# EAGLE design pipower-screw-gndplane (EAGLE 6.3)
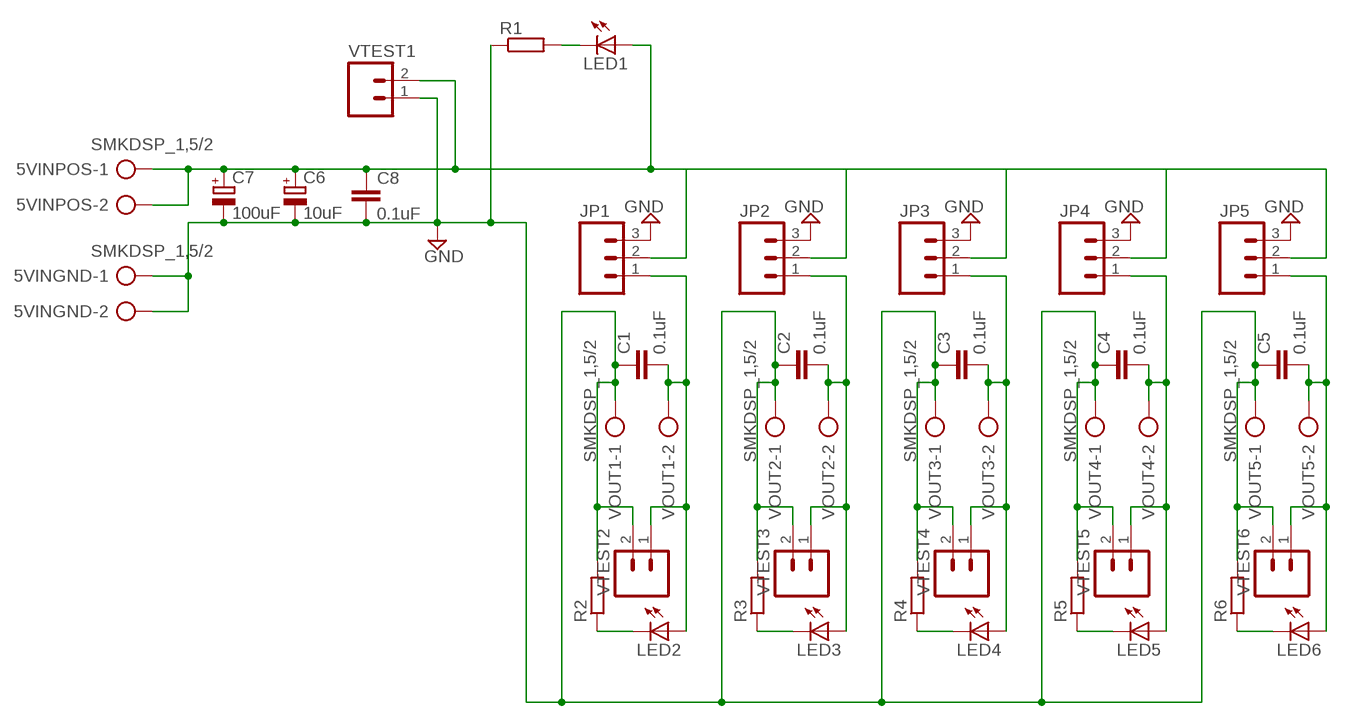
[diagram p0: schematic, sheet 1]

## Parts
5VINGND  SMKDSP_1,5/2  [SMKDSP_1,5/2]
5VINPOS  SMKDSP_1,5/2  [SMKDSP_1,5/2]
C1  0.1uF  CAPPTH1  [CAP-PTH-5MM]
C2  0.1uF  CAPPTH1  [CAP-PTH-5MM]
C3  0.1uF  CAPPTH1  [CAP-PTH-5MM]
C4  0.1uF  CAPPTH1  [CAP-PTH-5MM]
C5  0.1uF  CAPPTH1  [CAP-PTH-5MM]
C6  10uF  CPOL-EUE5-10.5  [E5-10,5]
C7  100uF  CPOL-EUE5-10.5  [E5-10,5]
C8  0.1uF  CAPPTH1  [CAP-PTH-5MM]
JP1  M03LONGPADS  [1X03_LONGPADS]
JP2  M03LONGPADS  [1X03_LONGPADS]
JP3  M03LONGPADS  [1X03_LONGPADS]
JP4  M03LONGPADS  [1X03_LONGPADS]
JP5  M03LONGPADS  [1X03_LONGPADS]
LED1  LED5MM  [LED5MM]
LED2  LED5MM  [LED5MM]
LED3  LED5MM  [LED5MM]
LED4  LED5MM  [LED5MM]
LED5  LED5MM  [LED5MM]
LED6  LED5MM  [LED5MM]
R1  R-EU_0207/12  [0207/12]
R2  R-EU_0207/12  [0207/12]
R3  R-EU_0207/12  [0207/12]
R4  R-EU_0207/12  [0207/12]
R5  R-EU_0207/12  [0207/12]
R6  R-EU_0207/12  [0207/12]
VOUT1  SMKDSP_1,5/2  [SMKDSP_1,5/2]
VOUT2  SMKDSP_1,5/2  [SMKDSP_1,5/2]
VOUT3  SMKDSP_1,5/2  [SMKDSP_1,5/2]
VOUT4  SMKDSP_1,5/2  [SMKDSP_1,5/2]
VOUT5  SMKDSP_1,5/2  [SMKDSP_1,5/2]
VTEST1  M02PTH3  [1X02_LONGPADS]
VTEST2  M02PTH3  [1X02_LONGPADS]
VTEST3  M02PTH3  [1X02_LONGPADS]
VTEST4  M02PTH3  [1X02_LONGPADS]
VTEST5  M02PTH3  [1X02_LONGPADS]
VTEST6  M02PTH3  [1X02_LONGPADS]

## Nets
GND: 5VINGND.1 5VINGND.2 C1.1 C2.1 C3.1 C4.1 C5.1 C6.- C7.- C8.2 JP1.3 JP2.3 JP3.3 JP4.3 JP5.3 R1.1 R2.2 R3.2 R4.2 R5.2 R6.2 VOUT1.1 VOUT2.1 VOUT3.1 VOUT4.1 VOUT5.1 VTEST1.1 VTEST2.2 VTEST3.2 VTEST4.2 VTEST5.2 VTEST6.2
MAINPOS: 5VINPOS.1 5VINPOS.2 C6.+ C7.+ C8.1 JP1.2 JP2.2 JP3.2 JP4.2 JP5.2 LED1.A VTEST1.2
N$1: LED2.K(C) R2.1
N$3: LED1.K(C) R1.2
N$4: LED3.K(C) R3.1
N$5: LED4.K(C) R4.1
N$6: LED5.K(C) R5.1
N$7: LED6.K(C) R6.1
POS1: C1.2 JP1.1 LED2.A VOUT1.2 VTEST2.1
POS2: C2.2 JP2.1 LED3.A VOUT2.2 VTEST3.1
POS3: C3.2 JP3.1 LED4.A VOUT3.2 VTEST4.1
POS4: C4.2 JP4.1 LED5.A VOUT4.2 VTEST5.1
POS5: C5.2 JP5.1 LED6.A VOUT5.2 VTEST6.1

## Library data of the parts
5VINGND 5VINPOS VOUT1-VOUT5 = con-phoenix-smkdsp:SMKDSP_1,5/2: Printklemme, Nennstrom: 17,5 A, Bemessungsspannung: 250 V, Raster: 5,0 mm Source: http://eshop.phoenixcontact.de .. 1733415.pdf; MF: FARNELL; MPN: 1733570; OC_FARNELL: 3041244; OC_NEWARK: 69C8588
C1-C5 C8 = SparkFun-Capacitors:CAP: Capacitor Standard 0603 ceramic capacitor, and 0.1" leaded capacitor.
C6 = rcl:CPOL-EU: POLARIZED CAPACITOR, European symbol
C7 = resistor:CPOL-EU: POLARIZED CAPACITOR, European symbol
JP1-JP5 = SparkFun-Connectors:M03: Header 3 Standard 3-pin 0.1" header. Use with straight break away headers (SKU : PRT-00116), right angle break away headers (PRT-00553), swiss pins (PRT-00743), machine pins (PRT-00117), and female headers (PRT-00115). Molex polarized connector foot print use with SKU : PRT-08232 with associated crimp pins and housings.
LED1-LED6 = led:LED: LED OSRAM: - CHIPLED LG R971, LG N971, LY N971, LG Q971, LY Q971, LO R971, LY R971 LH N974, LH R974 LS Q976, LO Q976, LY Q976 LO Q996 - Hyper CHIPLED LW Q18S LB Q993, LB Q99A, LB R99A - SideLED LS A670, LO A670, LY A670, LG A670, LP A670 LB A673, LV A673, LT A673, LW A673 LH A674 LY A675 LS A676, LA A676, LO A676, LY A676, LW A676 LS A679, LY A679, LG A679 - Hyper Micro SIDELED® LS Y876, LA Y876, LO Y876, LY Y876 LT Y87S - SmartLED LW L88C, LW L88S LB L89C, LB L89S, LG L890 LS L89K, LO L89K, LY L89K LS L896, LA L896, LO L896, LY L896 - TOPLED LS T670, LO T670, LY T670, LG T670, LP T670 LSG T670, LSP T670, LSY T670, LOP T670, LYG T670 LG T671, LOG T671, LSG T671 LB T673, LV T673, LT T673, LW T673 LH T674 LS T676, LA T676, LO T676, LY T676, LB T676, LH T676, LSB T676, LW T676 LB T67C, LV T67C, LT T67C, LS T67K, LO T67K, LY T67K, LW E67C LS E67B, LA E67B, LO E67B, LY E67B, LB E67C, LV E67C, LT E67C LW T67C LS T679, LY T679, LG T679 LS T770, LO T770, LY T770, LG T770, LP T770 LB T773, LV T773, LT T773, LW T773 LH T774 LS E675, LA E675, LY E675, LS T675 LS T776, LA T776, LO T776, LY T776, LB T776 LHGB T686 LT T68C, LB T68C - Hyper Mini TOPLED® LB M676 - Mini TOPLED Santana® LG M470 LS M47K, LO M47K, LY M47K Source: http://www.osram.convergy.de LUXEON: - LUMILED® LXK2-PW12-R00, LXK2-PW12-S00, LXK2-PW14-U00, LXK2-PW14-V00 LXK2-PM12-R00, LXK2-PM12-S00, LXK2-PM14-U00 LXK2-PE12-Q00, LXK2-PE12-R00, LXK2-PE12-S00, LXK2-PE14-T00, LXK2-PE14-U00 LXK2-PB12-K00, LXK2-PB12-L00, LXK2-PB12-M00, LXK2-PB14-N00, LXK2-PB14-P00, LXK2-PB14-Q00 LXK2-PR12-L00, LXK2-PR12-M00, LXK2-PR14-Q00, LXK2-PR14-R00 LXK2-PD12-Q00, LXK2-PD12-R00, LXK2-PD12-S00 LXK2-PH12-R00, LXK2-PH12-S00 LXK2-PL12-P00, LXK2-PL12-Q00, LXK2-PL12-R00 Source: www.luxeon.com KINGBRIGHT: KA-3528ASYC Source: www.kingbright.com
R1-R6 = resistor:R-EU_: RESISTOR, European symbol
VTEST1-VTEST6 = SparkFun-Connectors:M02: Header 2 Standard 2-pin 0.1" header. Use with straight break away headers (SKU : PRT-00116), right angle break away headers (PRT-00553), swiss pins (PRT-00743), machine pins (PRT-00117), and female headers (PRT-00115). Molex polarized connector foot print use with SKU : PRT-08233 with associated crimp pins and housings.

## Board
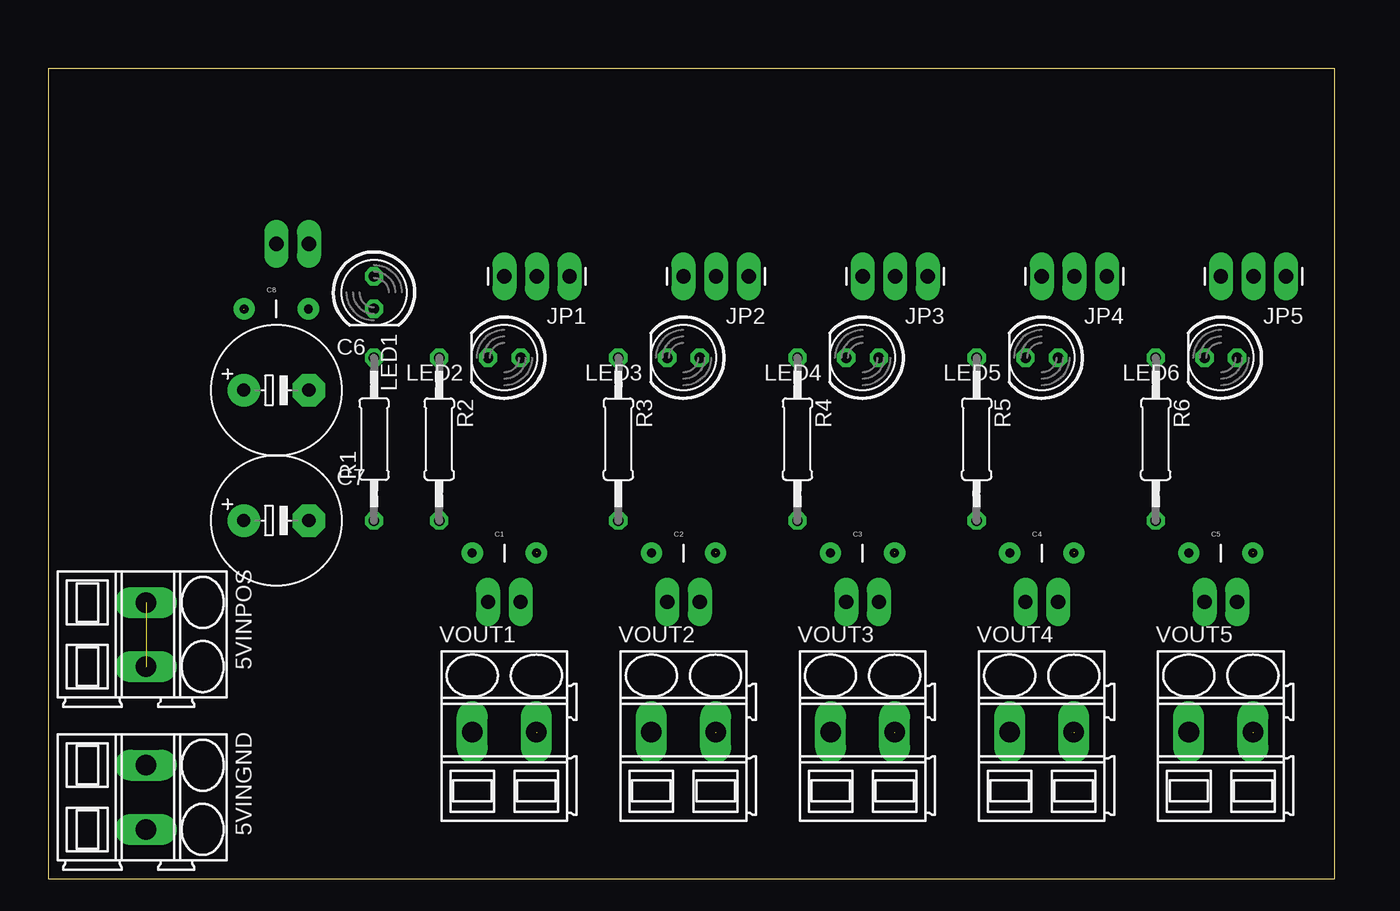
[diagram p1: board, top side]
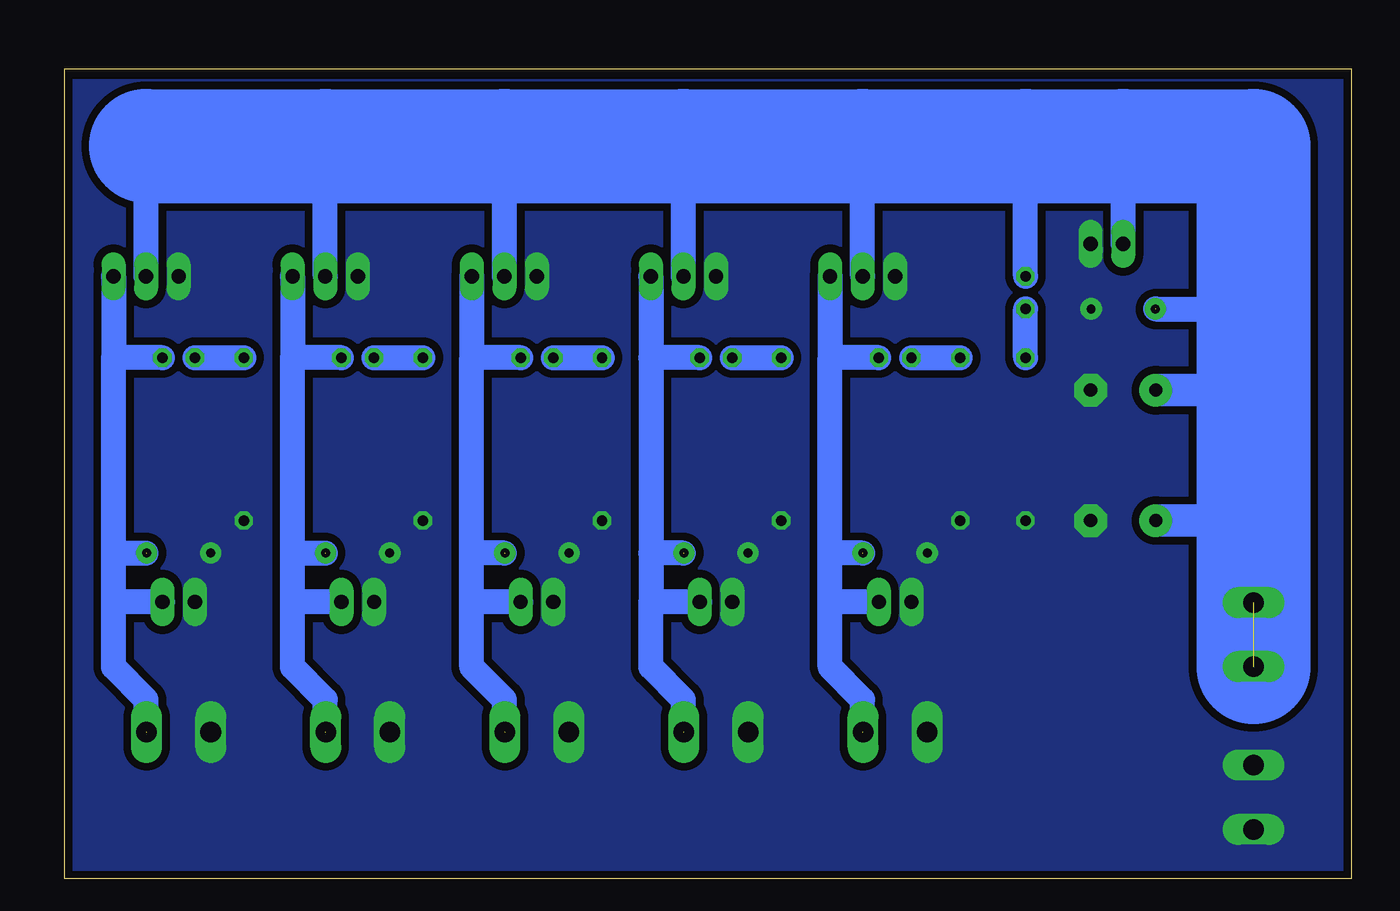
[diagram p2: board, bottom side, seen from below]

Size 100.31 x 63.17 mm. Coordinates in mm from the lower left corner, seen from the top.
Outline: 0,0 100.31,0 100.31,63.17 0,63.17 0,0
Copper layers (1*16): Top 0.035mm / dielectric 1.5mm / Bottom 0.035mm
Design rules "SparkFun": minimum track width 8mil, minimum drill 20mil, track to track 8mil, track to pad 8mil, pad to pad 8mil, via to via 8mil, smd to smd 8mil, copper to edge 8mil, drill to drill 8mil, minimum pad ring 12mil, minimum via ring 10mil, stop-mask expansion 4mil, vias tented up to drill 20mil, thermal gap 10mil

### Footprints (pad centres in the part's own frame; a part is rotated, then mirrored left to right if it is on the bottom)
SMKDSP_1,5/2 = drill 1.6 pad 1.8 long: 1 -2.5,0; 2 2.5,0
CAP-PTH-5MM = drill 0.7 pad 1.651: 1 -2.5,0; 2 2.5,0
E5-10,5 = drill 1.016 pad 2.54: + -2.54,0 | drill 1.016 pad 2.54 octagon: - 2.54,0
1X03_LONGPADS = drill 1.118 pad 1.88 long: 1 0,0; 2 2.54,0; 3 5.08,0
LED5MM = drill 0.813 octagon: A -1.27,0; K 1.27,0
0207/12 = drill 0.813 octagon: 1 -6.35,0; 2 6.35,0
1X02_LONGPADS = drill 1.118 pad 1.88 long: 1 0,0; 2 2.54,0

### Placement (x,y rotation side)
5VINGND  7.62,6.35 270 top
5VINPOS  7.62,19.05 270 top
C1  35.56,25.4 0 top
C2  49.53,25.4 0 top
C3  63.5,25.4 0 top
C4  77.47,25.4 0 top
C5  91.44,25.4 0 top
C6  17.78,38.1 0 top
C7  17.78,27.94 0 top
C8  17.78,44.45 0 top
JP1  40.64,46.99 180 top
JP2  54.61,46.99 180 top
JP3  68.58,46.99 180 top
JP4  82.55,46.99 180 top
JP5  96.52,46.99 180 top
LED1  25.4,45.72 270 top
LED2  35.56,40.64 180 top
LED3  49.53,40.64 180 top
LED4  63.5,40.64 180 top
LED5  77.47,40.64 180 top
LED6  91.44,40.64 180 top
R1  25.4,34.29 90 top
R2  30.48,34.29 270 top
R3  44.45,34.29 270 top
R4  58.42,34.29 270 top
R5  72.39,34.29 270 top
R6  86.36,34.29 270 top
VOUT1  35.56,11.43 0 top
VOUT2  49.53,11.43 0 top
VOUT3  63.5,11.43 0 top
VOUT4  77.47,11.43 0 top
VOUT5  91.44,11.43 0 top
VTEST1  20.32,49.53 180 top
VTEST2  36.83,21.59 180 top
VTEST3  50.8,21.59 180 top
VTEST4  64.77,21.59 180 top
VTEST5  78.74,21.59 180 top
VTEST6  92.71,21.59 180 top

### Tracks (layer width: path | path; a pad name or v marks a point on that pad's centre or on a via)
GND
  pour Bottom (isolate 0.61, no thermals): 0,0 100.33,0 100.33,62.23 0,62.23
MAINPOS  (3 unrouted)
  Bottom 1.93: LED1.A 25.4,57.15 | VTEST1.2 17.78,57.15 | 15.24,44.45 7.62,44.45 | JP1.2 38.1,57.15 | JP2.2 52.07,57.15 | JP3.2 66.04,57.15 | JP4.2 80.01,57.15 | JP5.2 93.98,57.15
  Bottom 2.54: C6.+ 7.62,38.1 | C7.+ 7.62,27.94
  Bottom 8.89: 93.98,57.15 80.01,57.15 66.04,57.15 52.07,57.15 38.1,57.15 25.4,57.15 17.78,57.15 7.62,57.15 7.62,44.45 7.62,38.1 7.62,27.94 7.62,16.51
N$1
  Bottom 1.93: LED2.K R2.1
N$3
  Bottom 1.93: R1.2 LED1.K
N$4
  Bottom 1.93: LED3.K R3.1
N$5
  Bottom 1.93: LED4.K R4.1
N$6
  Bottom 1.93: LED5.K R5.1
N$7
  Bottom 1.93: LED6.K R6.1
POS1  (2 unrouted)
  Bottom 1.93: 40.64,21.59 40.64,25.4 | VTEST2.1 40.64,21.59 | 38.1,25.4 40.64,25.4 | 40.64,25.4 40.64,40.64 | LED2.A 40.64,40.64 | 38.1,11.43 38.1,13.97 40.64,16.51 40.64,21.59 | JP1.1 40.64,40.64
POS2  (2 unrouted)
  Bottom 1.93: 52.07,25.4 54.61,25.4 | 54.61,25.4 54.61,21.59 | VTEST3.1 54.61,21.59 | 54.61,40.64 54.61,25.4 | LED3.A 54.61,40.64 | 52.07,11.43 52.07,13.97 54.61,16.51 54.61,21.59 | JP2.1 54.61,40.64
POS3  (2 unrouted)
  Bottom 1.93: 68.58,21.59 68.58,25.4 | VTEST4.1 68.58,21.59 | 66.04,25.4 68.58,25.4 | 68.58,25.4 68.58,40.64 | LED4.A 68.58,40.64 | 66.04,11.43 66.04,13.97 68.58,16.51 68.58,21.59 | JP3.1 68.58,40.64
POS4  (2 unrouted)
  Bottom 1.93: 82.55,21.59 82.55,25.4 | 82.55,25.4 80.01,25.4 | VTEST5.1 82.55,21.59 | 82.55,25.4 82.55,40.64 | 80.01,11.43 80.01,13.97 82.55,16.51 82.55,21.59 | LED5.A 82.55,40.64 | JP4.1 82.55,40.64
POS5  (2 unrouted)
  Bottom 1.93: 93.98,11.43 93.98,13.97 96.52,16.51 96.52,21.59 | 96.52,21.59 96.52,25.4 | 96.52,25.4 93.98,25.4 | VTEST6.1 96.52,21.59 | 96.52,25.4 96.52,40.64 | LED6.A 96.52,40.64 | JP5.1 96.52,40.64